# Altium project STM32F746_AppBoard.PrjPCB (part 2 of 2)
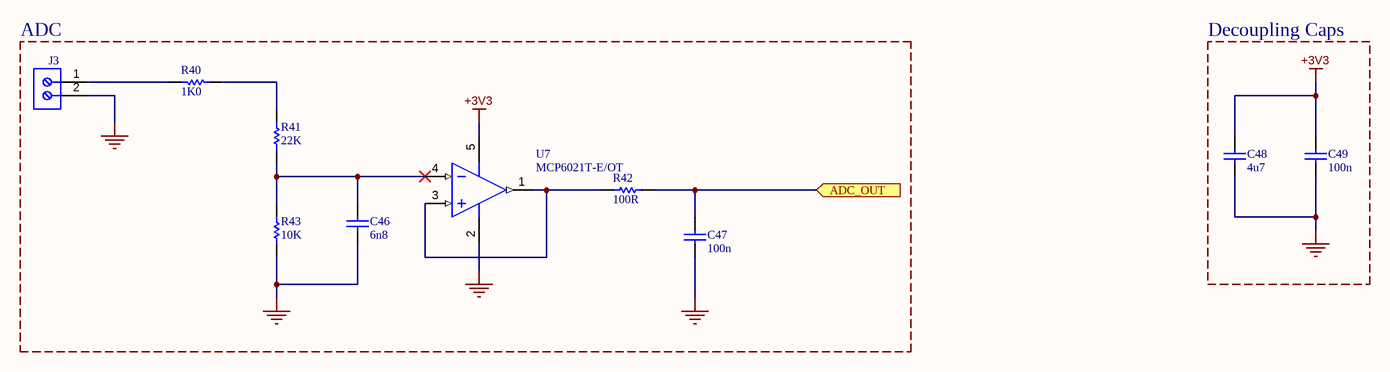
[diagram p9: ADC.SchDoc]

## Nets that join several sheets
+3V3: Connectors (P1.1 P2.1), Ethernet (8 pins), MCU (31 pins), USB (R30.2), SPI_Flash (5 pins), Power (6 pins), CAN1 (C39_1.1 C40_1.1 U6_1.5), CAN2 (C39_2.1 C40_2.1 U6_2.5), U_ADC (C48_1.1 C49_1.2 U7_1.5), U_ADC (C48_2.1 C49_2.2 U7_2.5)
+5V: Connectors (P2.2), Power (8 pins), CAN1 (C41_1.1 C42_1.1 U6_1.3), CAN2 (C41_2.1 C42_2.1 U6_2.3)
EGND: Ethernet (C35.1 J1.S1 J1.S2), Power (6 pins)
GND: Connectors (5 pins), Ethernet (18 pins), MCU (40 pins), USB (10 pins), SPI_Flash (C52.2 C53.2 U8.4), Power (25 pins), CAN1 (11 pins), CAN2 (11 pins), U_ADC (7 pins), U_ADC (7 pins)
VBUS_IN: MCU (R2.1), USB (CN1.1 D1.4 R33.1), Power (C62.1 FB1.1)
ADC_CH1: MCU (U1.19), U_ADC (C47_1.2 R42_1.1)
ADC_CH2: MCU (U1.21), U_ADC (C47_2.2 R42_2.1)
CAN1_RX: MCU (U1.114), CAN1 (R38_1.1)
CAN1_TX: MCU (U1.115), CAN1 (R37_1.1)
CAN2_RX: MCU (U1.73), CAN2 (R38_2.1)
CAN2_TX: MCU (U1.136), CAN2 (R37_2.1)
NetCN1_4: MCU (U1.102), USB (CN1.4 D1.3)
NetP1_2: Connectors (P1.2), MCU (U1.105)
NetP1_4: Connectors (P1.4), MCU (U1.109)
NetP1_7: Connectors (P1.7), MCU (U1.133)
NetR15_2: Ethernet (R15.2), MCU (U1.44)
NetR16_2: Ethernet (R16.2), MCU (U1.45)
NetR23_2: Ethernet (R23.2), MCU (U1.43)
NetR24_1: Ethernet (R24.1 U4.12), MCU (U1.36)
NetR29_2: Ethernet (R29.2), MCU (U1.35)
NetR50_2: MCU (U1.53), Power (R50.2 U11.1)
NetU1_1: MCU (U1.1), SPI_Flash (U8.6)
NetU1_3: MCU (U1.3), SPI_Flash (U8.1)
NetU1_4: MCU (U1.4), SPI_Flash (U8.2)
NetU1_5: MCU (U1.5), SPI_Flash (U8.5)
NetU1_27: Ethernet (U4.13), MCU (U1.27)
NetU1_74: Ethernet (U4.18), MCU (U1.74)
NetU1_126: Ethernet (U4.16), MCU (U1.126)
NetU1_128: Ethernet (U4.17), MCU (U1.128)
NRST: Connectors (P1.9), Ethernet (U4.15), MCU (B2.2 B2.3 C4.2 U1.25)
PB2: Connectors (P2.18), MCU (U1.48)
PB10: Connectors (P2.5), MCU (U1.69)
PB11: Connectors (P2.3), MCU (U1.70)
PE7: Connectors (P2.8), MCU (U1.58)
PE8: Connectors (P2.6), MCU (U1.59)
PE9: Connectors (P2.4), MCU (U1.60)
PE10: Connectors (P2.17), MCU (U1.63)
PE11: Connectors (P2.15), MCU (U1.64)
PE12: Connectors (P2.13), MCU (U1.65)
PE13: Connectors (P2.11), MCU (U1.66)
PE14: Connectors (P2.9), MCU (U1.67)
PE15: Connectors (P2.7), MCU (U1.68)
PF11: Connectors (P2.16), MCU (U1.49)
PF12: Connectors (P2.14), MCU (U1.50)
PG0: Connectors (P2.12), MCU (U1.56)
PG1: Connectors (P2.10), MCU (U1.57)
USB_D_N: MCU (U1.103), USB (CN1.2 D1.6)
USB_D_P: MCU (U1.104), USB (CN1.3 D1.1)